# Altium schematic sheet hotV1.1.SchDoc
size A2
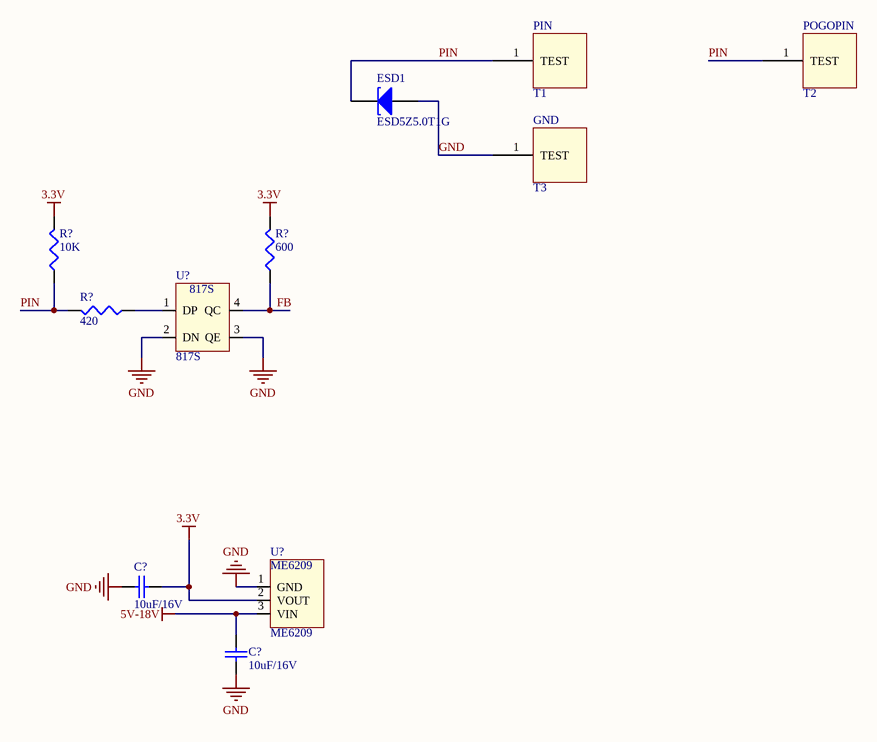
[diagram p0: hotV1.1.SchDoc]

## Parts
(Parts that share a designator on the sheet are numbered #1, #2 ... from top to bottom, then left to right.)
C?#1  10uF/16V  [C0603B]
C?#2  10uF/16V  [C0603B]
ESD1  ESD5Z5.0T1G  [LC-SOD-523]
GND  T3  [PIN]
PIN  T1  [PIN]
POGOPIN  T2  [POGOPIN]
R?#1  10K  [R0603B]
R?#2  600  [R0603B]
R?#3  420  [R0603B]
U?#1  817S
U?#2  ME6209

## Nets
3.3V: C?#1.1 R?#1.2 R?#2.2 U?#2.2(VOUT)
5V-18V: C?#2.2 U?#2.3(VIN)
GND: C?#1.2 C?#2.1 ESD1.1(A) GND.1(TEST) U?#1.2(DN) U?#1.3(QE) U?#2.1(GND)
FB: R?#2.1 U?#1.4(QC)
PIN: ESD1.2(K) PIN.1(TEST) POGOPIN.1(TEST) R?#1.1 R?#3.2
NetR?#3_1: R?#3.1 U?#1.1(DP)

## Library data of the parts
C?#1 C?#2 = Cap: Capacitor; Value: 0.1uF; Published: 8-Jun-2000; LatestRevisionDate: 17-Jul-2002; LatestRevisionNote: Re-released for DXP Platform.; PackageReference: RAD-0.3; Publisher: Altium Limited
ESD1 = D Tunnel2: Tunnel Diode - Dependent Source Model; Published: 15-Apr-2002; LatestRevisionDate: 17-Jul-2002; LatestRevisionNote: Re-released for DXP Platform.; PackageReference: DIODE-0.4; Publisher: Altium Limited; PackageDescription: Diode, Thru-Hole; 2 Leads; 0.4 in Pin Spacing
GND PIN POGOPIN = TEST_POINT
R?#1 = Res3: Resistor; Published: 8-Jun-2000; LatestRevisionDate: 29-May-2009; LatestRevisionNote: IPC-7351 Footprint Added.; PackageReference: J1-0603; Publisher: Altium Limited; Value: 10K; PackageDescription: Chip Resistor
R?#2 R?#3 = Res3: Resistor; Value: 10K; Published: 8-Jun-2000; LatestRevisionDate: 29-May-2009; LatestRevisionNote: IPC-7351 Footprint Added.; PackageReference: J1-0603; Publisher: Altium Limited; PackageDescription: Chip Resistor
U?#1 = 817S: 光耦芯片
U?#2 = ME6209: LDO芯片   VIN-16V OUT-3.3V  200ma